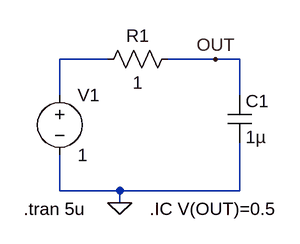
[diagram p0: schematic Fig_3-36_IC_UIC_OFF.asc]
Fig_3-36_IC_UIC_OFF.asc, the LTspice schematic file:
Version 4
SHEET 1 880 680
WIRE 176 80 112 80
WIRE 320 80 256 80
WIRE 352 80 320 80
WIRE 112 128 112 80
WIRE 352 128 352 80
WIRE 112 256 112 208
WIRE 192 256 112 256
WIRE 352 256 352 192
WIRE 352 256 192 256
WIRE 192 272 192 256
FLAG 192 272 0
FLAG 320 80 OUT
SYMBOL voltage 112 112 R0
WINDOW 123 0 0 Left 2
WINDOW 39 24 132 Left 2
SYMATTR InstName V1
SYMATTR Value 1
SYMBOL cap 336 128 R0
WINDOW 39 24 92 Left 2
SYMATTR InstName C1
SYMATTR Value 1µ
SYMBOL res 160 96 R270
WINDOW 0 32 56 VTop 2
WINDOW 3 0 56 VBottom 2
SYMATTR InstName R1
SYMATTR Value 1
TEXT 64 280 Left 2 !.tran 5u
TEXT 232 280 Left 2 !.IC V(OUT)=0.5

The netlist it stands for:
* Fig_3-36_IC_UIC_OFF.asc
V1 N001 0 1
C1 OUT 0 1µ
R1 N001 OUT 1
.tran 5u
.IC V(OUT)=0.5
.backanno
.end